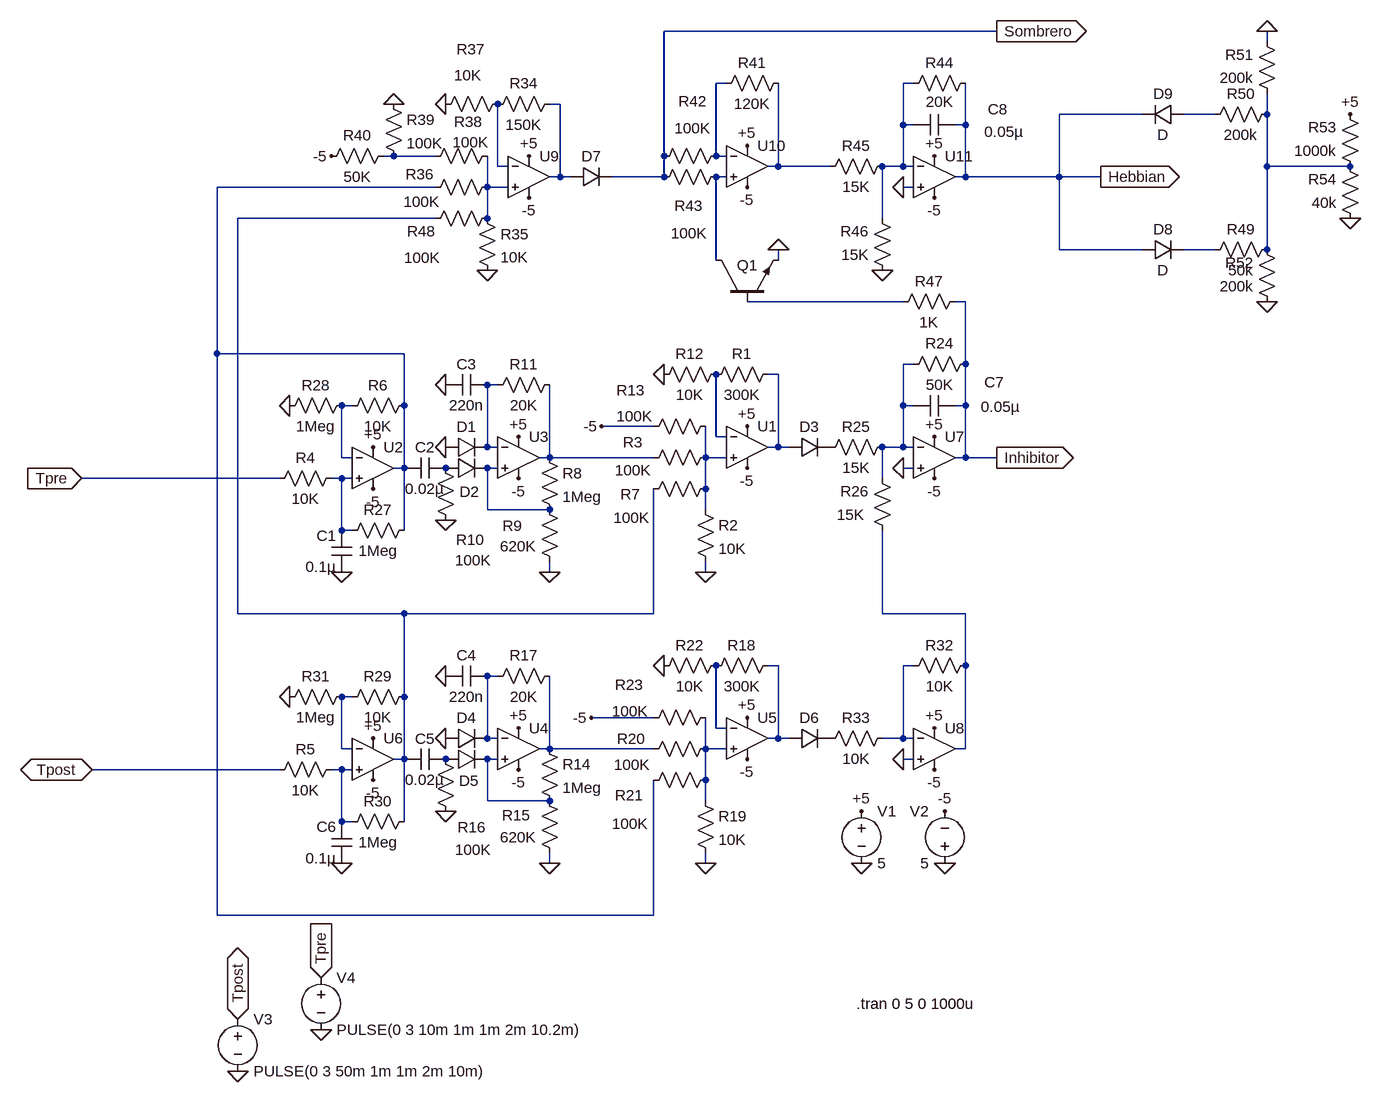
[diagram p0: schematic LF_sch.asc]
LF_sch.asc, the LTspice schematic file:
Version 4
SHEET 1 1184 1108
WIRE 608 -512 96 -512
WIRE 1024 -496 1024 -512
WIRE 192 -432 176 -432
WIRE 480 -432 464 -432
WIRE -64 -400 -80 -400
WIRE 832 -384 704 -384
WIRE 944 -384 896 -384
WIRE 1024 -384 1024 -416
WIRE 464 -368 464 -432
WIRE 480 -368 464 -368
WIRE 560 -368 560 -432
WIRE 560 -368 544 -368
WIRE -320 -320 -336 -320
WIRE -256 -320 -320 -320
WIRE 96 -320 96 -512
WIRE 176 -320 176 -432
WIRE 192 -320 176 -320
WIRE -160 -304 -160 -400
WIRE -144 -304 -160 -304
WIRE 272 -304 272 -432
WIRE 272 -304 256 -304
WIRE 352 -304 272 -304
WIRE 464 -304 464 -368
WIRE 464 -304 432 -304
WIRE 480 -304 464 -304
WIRE 1024 -304 1024 -384
WIRE 1152 -304 1024 -304
WIRE -64 -288 -64 -400
WIRE -64 -288 -80 -288
WIRE -48 -288 -64 -288
WIRE 96 -288 96 -320
WIRE 96 -288 16 -288
WIRE 192 -288 176 -288
WIRE 560 -288 560 -368
WIRE 560 -288 544 -288
WIRE 704 -288 704 -384
WIRE 704 -288 560 -288
WIRE 768 -288 704 -288
WIRE -256 -272 -592 -272
WIRE -176 -272 -176 -320
WIRE -144 -272 -176 -272
WIRE 480 -272 464 -272
WIRE -256 -224 -560 -224
WIRE -176 -224 -176 -272
WIRE 432 -224 432 -304
WIRE 704 -176 704 -288
WIRE 832 -176 704 -176
WIRE 944 -176 896 -176
WIRE 1024 -176 1024 -304
WIRE 176 -160 176 -288
WIRE 272 -160 272 -176
WIRE 464 -96 224 -96
WIRE 560 -96 544 -96
WIRE -592 -16 -592 -272
WIRE -304 -16 -592 -16
WIRE 480 0 464 0
WIRE 560 0 560 -96
WIRE 272 16 256 16
WIRE -160 32 -176 32
WIRE -384 64 -400 64
WIRE -304 64 -304 -16
WIRE 464 64 464 0
WIRE 480 64 464 64
WIRE 560 64 560 0
WIRE 560 64 544 64
WIRE 80 96 0 96
WIRE 176 112 176 16
WIRE 192 112 176 112
WIRE -176 128 -176 32
WIRE -160 128 -176 128
WIRE 272 128 272 16
WIRE 272 128 256 128
WIRE 288 128 272 128
WIRE 464 128 464 64
WIRE 464 128 432 128
WIRE 480 128 464 128
WIRE -400 144 -400 64
WIRE -384 144 -400 144
WIRE -80 144 -80 32
WIRE -80 144 -96 144
WIRE 80 144 -80 144
WIRE 160 144 160 96
WIRE 192 144 160 144
WIRE 560 144 560 64
WIRE 560 144 544 144
WIRE 608 144 560 144
WIRE -304 160 -304 64
WIRE -304 160 -320 160
WIRE -160 160 -176 160
WIRE 480 160 464 160
WIRE -496 176 -800 176
WIRE -400 176 -416 176
WIRE -384 176 -400 176
WIRE 432 176 432 128
WIRE 160 192 160 144
WIRE -176 224 -176 160
WIRE -80 224 -176 224
WIRE 160 224 160 192
WIRE -400 256 -400 176
WIRE -384 256 -400 256
WIRE -304 256 -304 160
WIRE -80 320 -80 304
WIRE 160 320 160 304
WIRE -560 384 -560 -224
WIRE -304 384 -560 384
WIRE 80 384 80 192
WIRE 80 384 -304 384
WIRE 432 384 432 256
WIRE 560 384 432 384
WIRE 272 464 256 464
WIRE 480 464 464 464
WIRE 560 464 560 384
WIRE -160 480 -176 480
WIRE -384 512 -400 512
WIRE -304 512 -304 384
WIRE 80 544 -16 544
WIRE 176 560 176 464
WIRE 192 560 176 560
WIRE -176 576 -176 480
WIRE -160 576 -176 576
WIRE 272 576 272 464
WIRE 272 576 256 576
WIRE 288 576 272 576
WIRE 464 576 464 464
WIRE 464 576 432 576
WIRE 480 576 464 576
WIRE -400 592 -400 512
WIRE -384 592 -400 592
WIRE -80 592 -80 480
WIRE -80 592 -96 592
WIRE 80 592 -80 592
WIRE 160 592 160 544
WIRE 192 592 160 592
WIRE 560 592 560 464
WIRE 560 592 544 592
WIRE -304 608 -304 512
WIRE -304 608 -320 608
WIRE -160 608 -176 608
WIRE 480 608 464 608
WIRE -496 624 -784 624
WIRE -400 624 -416 624
WIRE -384 624 -400 624
WIRE 160 640 160 592
WIRE -176 672 -176 608
WIRE -80 672 -176 672
WIRE 160 672 160 640
WIRE -400 704 -400 624
WIRE -384 704 -400 704
WIRE -304 704 -304 608
WIRE -80 768 -80 752
WIRE 160 768 160 752
WIRE -592 848 -592 -16
WIRE 80 848 80 640
WIRE 80 848 -592 848
FLAG 224 96 +5
FLAG 224 160 -5
FLAG -352 128 +5
FLAG -352 192 -5
FLAG -128 112 +5
FLAG -128 176 -5
FLAG -240 128 0
FLAG -240 32 0
FLAG -240 240 0
FLAG 96 16 0
FLAG 0 96 -5
FLAG -128 560 +5
FLAG -128 624 -5
FLAG -240 576 0
FLAG -240 480 0
FLAG -240 688 0
FLAG -80 768 0
FLAG -80 320 0
FLAG 224 544 +5
FLAG 224 608 -5
FLAG 96 464 0
FLAG -16 544 -5
FLAG -400 320 0
FLAG -480 64 0
FLAG -352 576 +5
FLAG -352 640 -5
FLAG -400 768 0
FLAG -480 512 0
FLAG 512 112 +5
FLAG 512 176 -5
FLAG 512 560 +5
FLAG 512 624 -5
FLAG 464 608 0
FLAG 464 160 0
FLAG 160 320 0
FLAG 160 768 0
FLAG 608 144 Inhibitor
IOPIN 608 144 Out
FLAG -112 -320 +5
FLAG -112 -256 -5
FLAG -240 -400 0
FLAG -320 -400 0
FLAG 224 -336 +5
FLAG 224 -272 -5
FLAG -416 -320 -5
FLAG 512 -320 +5
FLAG 512 -256 -5
FLAG 464 -272 0
FLAG 432 -144 0
FLAG 272 -176 0
FLAG 768 -288 Hebbian
IOPIN 768 -288 Out
FLAG 608 -512 Sombrero
IOPIN 608 -512 Out
FLAG 400 768 0
FLAG 528 768 0
FLAG 528 688 -5
FLAG 400 688 +5
FLAG -784 624 Tpost
IOPIN -784 624 BiDir
FLAG -176 -144 0
FLAG -800 176 Tpre
IOPIN -800 176 In
FLAG 1024 -96 0
FLAG 1024 -512 0
FLAG 1152 -224 0
FLAG 1152 -384 +5
FLAG -560 1088 0
FLAG -432 1024 0
FLAG -432 944 Tpre
IOPIN -432 944 In
FLAG -560 1008 Tpost
IOPIN -560 1008 BiDir
SYMBOL Opamps\\UniversalOpamp2 224 128 R0
SYMATTR InstName U1
SYMBOL res 272 0 R90
WINDOW 0 0 56 VBottom 2
WINDOW 3 32 56 VTop 2
SYMATTR InstName R1
SYMATTR Value 300K
SYMBOL res 144 208 R0
SYMATTR InstName R2
SYMATTR Value 10K
SYMBOL res 176 128 R90
WINDOW 0 8 128 VBottom 2
WINDOW 3 20 127 VTop 2
SYMATTR InstName R3
SYMATTR Value 100K
SYMBOL Opamps\\UniversalOpamp2 -352 160 R0
SYMATTR InstName U2
SYMBOL cap -384 320 R180
WINDOW 0 24 56 Left 2
WINDOW 3 24 8 Left 2
SYMATTR InstName C1
SYMATTR Value 0.1µ
SYMBOL res -400 160 R90
WINDOW 0 0 56 VBottom 2
WINDOW 3 32 56 VTop 2
SYMATTR InstName R4
SYMATTR Value 10K
SYMBOL res -400 608 R90
WINDOW 0 0 56 VBottom 2
WINDOW 3 32 56 VTop 2
SYMATTR InstName R5
SYMATTR Value 10K
SYMBOL res -288 48 R90
WINDOW 0 0 56 VBottom 2
WINDOW 3 32 56 VTop 2
SYMATTR InstName R6
SYMATTR Value 10K
SYMBOL res 176 176 R90
WINDOW 0 40 132 VBottom 2
WINDOW 3 45 130 VTop 2
SYMATTR InstName R7
SYMATTR Value 100K
SYMBOL Opamps\\UniversalOpamp2 -128 144 R0
SYMATTR InstName U3
SYMBOL diode -240 144 R270
WINDOW 0 32 32 VTop 2
WINDOW 3 0 32 Invisible 2
SYMATTR InstName D1
SYMBOL diode -240 176 R270
WINDOW 0 -36 37 VTop 2
WINDOW 3 0 32 Invisible 2
SYMATTR InstName D2
SYMBOL res -96 128 R0
SYMATTR InstName R8
SYMATTR Value 1Meg
SYMBOL res -64 320 R180
WINDOW 0 58 71 Left 2
WINDOW 3 36 40 Left 2
SYMATTR InstName R9
SYMATTR Value 620K
SYMBOL res -256 144 R0
WINDOW 0 32 126 Left 2
WINDOW 3 30 158 Left 2
SYMATTR InstName R10
SYMATTR Value 100K
SYMBOL cap -240 144 R90
WINDOW 0 0 32 VBottom 2
WINDOW 3 32 32 VTop 2
SYMATTR InstName C2
SYMATTR Value 0.02µ
SYMBOL res -64 16 R90
WINDOW 0 0 56 VBottom 2
WINDOW 3 32 56 VTop 2
SYMATTR InstName R11
SYMATTR Value 20K
SYMBOL cap -176 16 R90
WINDOW 0 0 32 VBottom 2
WINDOW 3 32 32 VTop 2
SYMATTR InstName C3
SYMATTR Value 220n
SYMBOL res 80 32 R270
WINDOW 0 32 56 VTop 2
WINDOW 3 0 56 VBottom 2
SYMATTR InstName R12
SYMATTR Value 10K
SYMBOL diode 288 144 R270
WINDOW 0 32 32 VTop 2
WINDOW 3 0 32 Invisible 2
SYMATTR InstName D3
SYMBOL res 176 80 R90
WINDOW 0 -24 131 VBottom 2
WINDOW 3 -15 125 VTop 2
SYMATTR InstName R13
SYMATTR Value 100K
SYMBOL Opamps\\UniversalOpamp2 -128 592 R0
SYMATTR InstName U4
SYMBOL diode -240 592 R270
WINDOW 0 32 32 VTop 2
WINDOW 3 0 32 Invisible 2
SYMATTR InstName D4
SYMBOL diode -240 624 R270
WINDOW 0 -33 36 VTop 2
WINDOW 3 0 32 Invisible 2
SYMATTR InstName D5
SYMBOL res -96 576 R0
SYMATTR InstName R14
SYMATTR Value 1Meg
SYMBOL res -64 768 R180
WINDOW 0 45 74 Left 2
WINDOW 3 36 40 Left 2
SYMATTR InstName R15
SYMATTR Value 620K
SYMBOL res -256 592 R0
WINDOW 0 34 121 Left 2
WINDOW 3 30 155 Left 2
SYMATTR InstName R16
SYMATTR Value 100K
SYMBOL res -64 464 R90
WINDOW 0 0 56 VBottom 2
WINDOW 3 32 56 VTop 2
SYMATTR InstName R17
SYMATTR Value 20K
SYMBOL cap -176 464 R90
WINDOW 0 0 32 VBottom 2
WINDOW 3 32 32 VTop 2
SYMATTR InstName C4
SYMATTR Value 220n
SYMBOL cap -240 592 R90
WINDOW 0 0 32 VBottom 2
WINDOW 3 32 32 VTop 2
SYMATTR InstName C5
SYMATTR Value 0.02µ
SYMBOL Opamps\\UniversalOpamp2 224 576 R0
SYMATTR InstName U5
SYMBOL res 272 448 R90
WINDOW 0 0 56 VBottom 2
WINDOW 3 32 56 VTop 2
SYMATTR InstName R18
SYMATTR Value 300K
SYMBOL res 144 656 R0
SYMATTR InstName R19
SYMATTR Value 10K
SYMBOL res 176 576 R90
WINDOW 0 16 130 VBottom 2
WINDOW 3 25 129 VTop 2
SYMATTR InstName R20
SYMATTR Value 100K
SYMBOL res 176 624 R90
WINDOW 0 55 133 VBottom 2
WINDOW 3 68 132 VTop 2
SYMATTR InstName R21
SYMATTR Value 100K
SYMBOL res 80 480 R270
WINDOW 0 32 56 VTop 2
WINDOW 3 0 56 VBottom 2
SYMATTR InstName R22
SYMATTR Value 10K
SYMBOL diode 288 592 R270
WINDOW 0 32 32 VTop 2
WINDOW 3 0 32 Invisible 2
SYMATTR InstName D6
SYMBOL res 176 528 R90
WINDOW 0 -19 133 VBottom 2
WINDOW 3 -9 132 VTop 2
SYMATTR InstName R23
SYMATTR Value 100K
SYMBOL res 576 -16 R90
WINDOW 0 0 56 VBottom 2
WINDOW 3 32 56 VTop 2
SYMATTR InstName R24
SYMATTR Value 50K
SYMBOL res 448 112 R90
WINDOW 0 0 56 VBottom 2
WINDOW 3 32 56 VTop 2
SYMATTR InstName R25
SYMATTR Value 15K
SYMBOL res 448 272 R180
WINDOW 0 36 76 Left 2
WINDOW 3 43 40 Left 2
SYMATTR InstName R26
SYMATTR Value 15K
SYMBOL res -288 240 R90
WINDOW 0 0 56 VBottom 2
WINDOW 3 32 56 VTop 2
SYMATTR InstName R27
SYMATTR Value 1Meg
SYMBOL res -384 48 R90
WINDOW 0 0 56 VBottom 2
WINDOW 3 32 56 VTop 2
SYMATTR InstName R28
SYMATTR Value 1Meg
SYMBOL Opamps\\UniversalOpamp2 -352 608 R0
SYMATTR InstName U6
SYMBOL cap -384 768 R180
WINDOW 0 24 56 Left 2
WINDOW 3 24 8 Left 2
SYMATTR InstName C6
SYMATTR Value 0.1µ
SYMBOL res -288 496 R90
WINDOW 0 0 56 VBottom 2
WINDOW 3 32 56 VTop 2
SYMATTR InstName R29
SYMATTR Value 10K
SYMBOL res -288 688 R90
WINDOW 0 0 56 VBottom 2
WINDOW 3 32 56 VTop 2
SYMATTR InstName R30
SYMATTR Value 1Meg
SYMBOL res -384 496 R90
WINDOW 0 0 56 VBottom 2
WINDOW 3 32 56 VTop 2
SYMATTR InstName R31
SYMATTR Value 1Meg
SYMBOL Opamps\\UniversalOpamp2 512 144 R0
SYMATTR InstName U7
SYMBOL res 576 448 R90
WINDOW 0 0 56 VBottom 2
WINDOW 3 32 56 VTop 2
SYMATTR InstName R32
SYMATTR Value 10K
SYMBOL Opamps\\UniversalOpamp2 512 592 R0
SYMATTR InstName U8
SYMBOL res 448 560 R90
WINDOW 0 0 56 VBottom 2
WINDOW 3 32 56 VTop 2
SYMATTR InstName R33
SYMATTR Value 10K
SYMBOL cap 544 48 R90
WINDOW 0 -4 -60 VBottom 2
WINDOW 3 2 -70 VTop 2
SYMATTR InstName C7
SYMATTR Value 0.05µ
SYMBOL Opamps\\UniversalOpamp2 -112 -288 R0
SYMATTR InstName U9
SYMBOL res -64 -416 R90
WINDOW 0 0 56 VBottom 2
WINDOW 3 32 56 VTop 2
SYMATTR InstName R34
SYMATTR Value 150K
SYMBOL res -192 -240 R0
SYMATTR InstName R35
SYMATTR Value 10K
SYMBOL res -160 -288 R90
WINDOW 0 12 120 VBottom 2
WINDOW 3 23 117 VTop 2
SYMATTR InstName R36
SYMATTR Value 100K
SYMBOL res -256 -384 R270
WINDOW 0 85 55 VTop 2
WINDOW 3 76 50 VBottom 2
SYMATTR InstName R37
SYMATTR Value 10K
SYMBOL res -160 -336 R90
WINDOW 0 -21 45 VBottom 2
WINDOW 3 -21 41 VTop 2
SYMATTR InstName R38
SYMATTR Value 100K
SYMBOL res -336 -416 R0
SYMATTR InstName R39
SYMATTR Value 100K
SYMBOL res -320 -336 R90
WINDOW 0 0 56 VBottom 2
WINDOW 3 32 56 VTop 2
SYMATTR InstName R40
SYMATTR Value 50K
SYMBOL diode -48 -272 R270
WINDOW 0 32 32 VTop 2
WINDOW 3 0 32 Invisible 2
SYMATTR InstName D7
SYMBOL res 288 -448 R90
WINDOW 0 0 56 VBottom 2
WINDOW 3 32 56 VTop 2
SYMATTR InstName R41
SYMATTR Value 120K
SYMBOL Opamps\\UniversalOpamp2 224 -304 R0
SYMATTR InstName U10
SYMBOL res 192 -336 R90
WINDOW 0 -53 52 VBottom 2
WINDOW 3 -42 52 VTop 2
SYMATTR InstName R42
SYMATTR Value 100K
SYMBOL res 192 -304 R90
WINDOW 0 76 58 VBottom 2
WINDOW 3 87 57 VTop 2
SYMATTR InstName R43
SYMATTR Value 100K
SYMBOL npn 176 -96 R270
WINDOW 0 56 32 VRight 2
WINDOW 3 56 68 Invisible 2
SYMATTR InstName Q1
SYMBOL res 576 -448 R90
WINDOW 0 0 56 VBottom 2
WINDOW 3 60 56 VBottom 2
SYMATTR InstName R44
SYMATTR Value 20K
SYMBOL res 448 -320 R90
WINDOW 0 0 56 VBottom 2
WINDOW 3 32 56 VTop 2
SYMATTR InstName R45
SYMATTR Value 15K
SYMBOL res 448 -128 R180
WINDOW 0 36 76 Left 2
WINDOW 3 36 40 Left 2
SYMATTR InstName R46
SYMATTR Value 15K
SYMBOL Opamps\\UniversalOpamp2 512 -288 R0
SYMATTR InstName U11
SYMBOL cap 544 -384 R90
WINDOW 0 8 -66 VBottom 2
WINDOW 3 11 -75 VTop 2
SYMATTR InstName C8
SYMATTR Value 0.05µ
SYMBOL res 448 -80 R270
WINDOW 0 32 56 VTop 2
WINDOW 3 0 56 VBottom 2
SYMATTR InstName R47
SYMATTR Value 1K
SYMBOL voltage 400 672 R0
WINDOW 123 0 0 Left 2
WINDOW 39 0 0 Left 2
SYMATTR InstName V1
SYMATTR Value 5
SYMBOL voltage 528 784 R180
WINDOW 0 24 96 Left 2
WINDOW 3 24 16 Left 2
WINDOW 123 0 0 Left 2
WINDOW 39 0 0 Left 2
SYMATTR InstName V2
SYMATTR Value 5
SYMBOL res -160 -240 R90
WINDOW 0 51 117 VBottom 2
WINDOW 3 61 116 VTop 2
SYMATTR InstName R48
SYMATTR Value 100K
SYMBOL diode 832 -160 R270
WINDOW 0 32 32 VTop 2
WINDOW 3 0 32 VBottom 2
SYMATTR InstName D8
SYMBOL diode 896 -400 R90
WINDOW 0 0 32 VBottom 2
WINDOW 3 32 32 VTop 2
SYMATTR InstName D9
SYMBOL res 1040 -192 R90
WINDOW 0 0 56 VBottom 2
WINDOW 3 32 56 VTop 2
SYMATTR InstName R49
SYMATTR Value 50k
SYMBOL res 1040 -400 R90
WINDOW 0 0 56 VBottom 2
WINDOW 3 32 56 VTop 2
SYMATTR InstName R50
SYMATTR Value 200k
SYMBOL res 1040 -400 R180
WINDOW 0 36 76 Left 2
WINDOW 3 36 40 Left 2
SYMATTR InstName R51
SYMATTR Value 200k
SYMBOL res 1040 -80 R180
WINDOW 0 36 76 Left 2
WINDOW 3 36 40 Left 2
SYMATTR InstName R52
SYMATTR Value 200k
SYMBOL res 1168 -288 R180
WINDOW 0 36 76 Left 2
WINDOW 3 36 40 Left 2
SYMATTR InstName R53
SYMATTR Value 1000k
SYMBOL res 1168 -208 R180
WINDOW 0 36 76 Left 2
WINDOW 3 36 40 Left 2
SYMATTR InstName R54
SYMATTR Value 40k
SYMBOL voltage -560 992 R0
WINDOW 123 0 0 Left 2
WINDOW 39 0 0 Left 2
SYMATTR InstName V3
SYMATTR Value PULSE(0 3 50m 1m 1m 2m 10m)
SYMBOL voltage -432 928 R0
WINDOW 123 0 0 Left 2
WINDOW 39 0 0 Left 2
SYMATTR InstName V4
SYMATTR Value PULSE(0 3 10m 1m 1m 2m 10.2m)
TEXT 392 984 Left 2 !.tran 0 5 0 1000u

The netlist it stands for:
* LF_sch.asc
XU1 N021 N019 +5 -5 N016 level.2 Avol=1Meg GBW=10Meg Slew=10Meg ilimit=25m rail=0 Vos=0 phimargin=45 en=0 enk=0 in=0 ink=0 Rin=500Meg  ; pins IN+ IN- V+ V- OUT
R1 N016 N019 300K
R2 N021 0 10K
R3 N021 N020 100K
XU2 N023 N018 +5 -5 N010 level.2 Avol=1Meg GBW=10Meg Slew=10Meg ilimit=25m rail=0 Vos=0 phimargin=45 en=0 enk=0 in=0 ink=0 Rin=500Meg  ; pins IN+ IN- V+ V- OUT
C1 0 N023 0.1µ
R4 N023 Tpre 10K
R5 N033 Tpost 10K
R6 N010 N018 10K
R7 N021 N012 100K
XU3 N022 N017 +5 -5 N020 level.2 Avol=1Meg GBW=10Meg Slew=10Meg ilimit=25m rail=0 Vos=0 phimargin=45 en=0 enk=0 in=0 ink=0 Rin=500Meg  ; pins IN+ IN- V+ V- OUT
D1 0 N017 D
D2 P001 N022 D
R8 N020 N022 1Meg
R9 0 N022 620K
R10 P001 0 100K
C2 P001 N010 0.02µ
R11 N020 N017 20K
C3 N017 0 220n
R12 0 N019 10K
D3 N016 P002 D
R13 N021 -5 100K
XU4 N032 N027 +5 -5 N030 level.2 Avol=1Meg GBW=10Meg Slew=10Meg ilimit=25m rail=0 Vos=0 phimargin=45 en=0 enk=0 in=0 ink=0 Rin=500Meg  ; pins IN+ IN- V+ V- OUT
D4 0 N027 D
D5 P003 N032 D
R14 N030 N032 1Meg
R15 0 N032 620K
R16 P003 0 100K
R17 N030 N027 20K
C4 N027 0 220n
C5 P003 N012 0.02µ
XU5 N031 N029 +5 -5 N025 level.2 Avol=1Meg GBW=10Meg Slew=10Meg ilimit=25m rail=0 Vos=0 phimargin=45 en=0 enk=0 in=0 ink=0 Rin=500Meg  ; pins IN+ IN- V+ V- OUT
R18 N025 N029 300K
R19 N031 0 10K
R20 N031 N030 100K
R21 N031 N010 100K
R22 0 N029 10K
D6 N025 P004 D
R23 N031 -5 100K
R24 Inhibitor N015 50K
R25 N015 P002 15K
R26 N024 N015 15K
R27 N010 N023 1Meg
R28 N018 0 1Meg
XU6 N033 N028 +5 -5 N012 level.2 Avol=1Meg GBW=10Meg Slew=10Meg ilimit=25m rail=0 Vos=0 phimargin=45 en=0 enk=0 in=0 ink=0 Rin=500Meg  ; pins IN+ IN- V+ V- OUT
C6 0 N033 0.1µ
R29 N012 N028 10K
R30 N012 N033 1Meg
R31 N028 0 1Meg
XU7 0 N015 +5 -5 Inhibitor level.2 Avol=1Meg GBW=10Meg Slew=10Meg ilimit=25m rail=0 Vos=0 phimargin=45 en=0 enk=0 in=0 ink=0 Rin=500Meg  ; pins IN+ IN- V+ V- OUT
R32 N024 N026 10K
XU8 0 N026 +5 -5 N024 level.2 Avol=1Meg GBW=10Meg Slew=10Meg ilimit=25m rail=0 Vos=0 phimargin=45 en=0 enk=0 in=0 ink=0 Rin=500Meg  ; pins IN+ IN- V+ V- OUT
R33 N026 P004 10K
C7 Inhibitor N015 0.05µ
XU9 N011 N007 +5 -5 N003 level.2 Avol=1Meg GBW=10Meg Slew=10Meg ilimit=25m rail=0 Vos=0 phimargin=45 en=0 enk=0 in=0 ink=0 Rin=500Meg  ; pins IN+ IN- V+ V- OUT
R34 N003 N007 150K
R35 N011 0 10K
R36 N011 N010 100K
R37 0 N007 10K
R38 N011 N006 100K
R39 0 N006 100K
R40 N006 -5 50K
D7 N003 Sombrero D
R41 N008 N001 120K
XU10 N009 N001 +5 -5 N008 level.2 Avol=1Meg GBW=10Meg Slew=10Meg ilimit=25m rail=0 Vos=0 phimargin=45 en=0 enk=0 in=0 ink=0 Rin=500Meg  ; pins IN+ IN- V+ V- OUT
R42 N001 Sombrero 100K
R43 N009 Sombrero 100K
Q1 N009 N014 0 0 NPN
R44 Hebbian N002 20K
R45 N002 N008 15K
R46 0 N002 15K
XU11 0 N002 +5 -5 Hebbian level.2 Avol=1Meg GBW=10Meg Slew=10Meg ilimit=25m rail=0 Vos=0 phimargin=45 en=0 enk=0 in=0 ink=0 Rin=500Meg  ; pins IN+ IN- V+ V- OUT
C8 Hebbian N002 0.05µ
R47 N014 Inhibitor 1K
V1 +5 0 5
V2 0 -5 5
R48 N011 N012 100K
D8 Hebbian N013 D
D9 N004 Hebbian D
R49 N005 N013 50k
R50 N005 N004 200k
R51 N005 0 200k
R52 0 N005 200k
R53 N005 +5 1000k
R54 0 N005 40k
V3 Tpost 0 PULSE(0 3 50m 1m 1m 2m 10m)
V4 Tpre 0 PULSE(0 3 10m 1m 1m 2m 10.2m)
.model D D
.lib standard.dio
.model NPN NPN
.model PNP PNP
.lib standard.bjt
.tran 0 5 0 1000u
.lib UniversalOpamps2.sub
.backanno
.end